# EAGLE schematic F7&UI&keyholder (EAGLE 9.4.0)
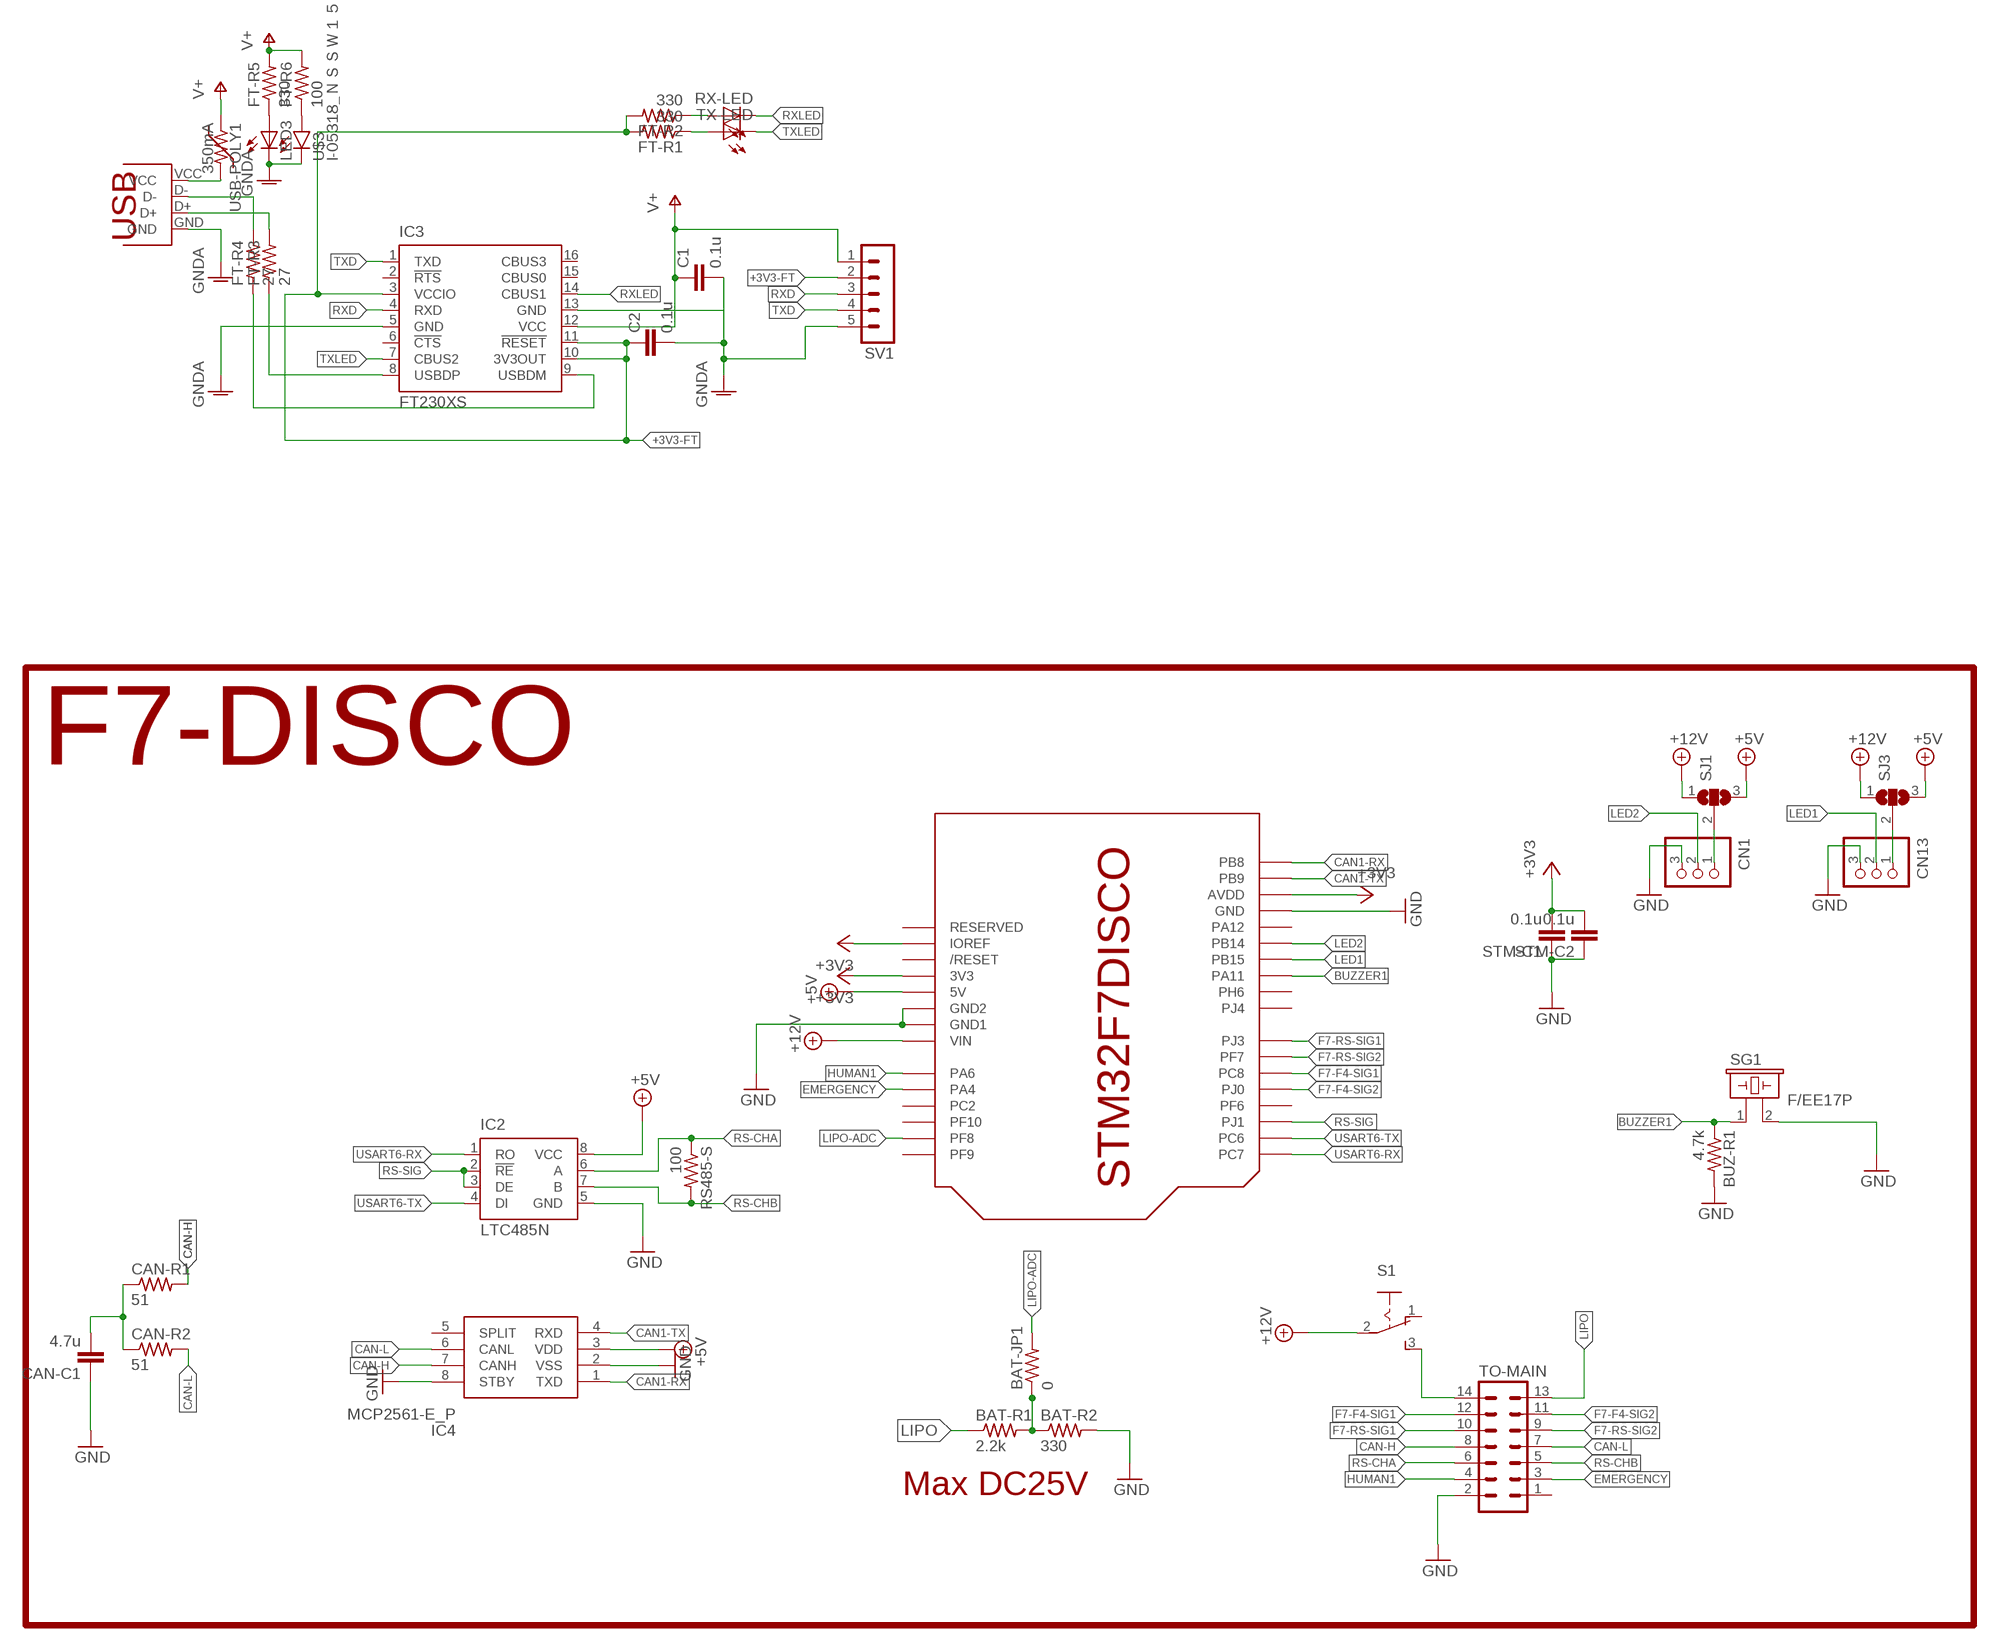
[diagram p0: schematic, sheet 1, part 1 of 2]
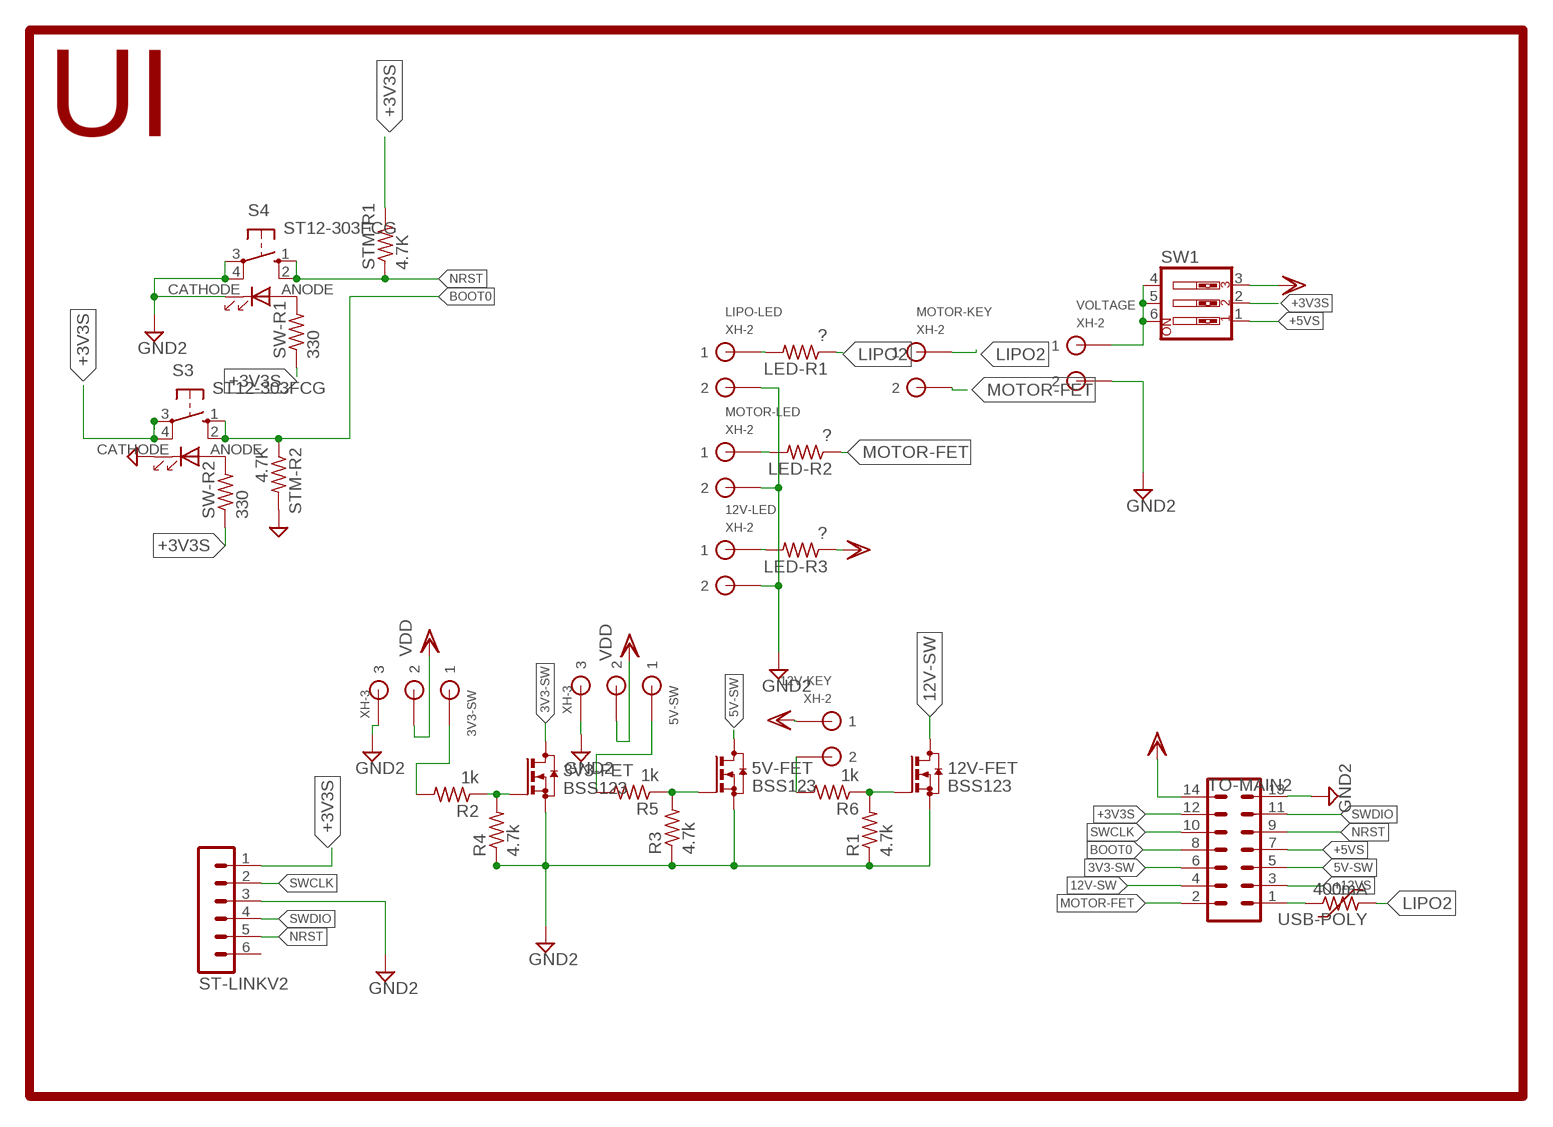
[diagram p1: schematic, sheet 1, part 2 of 2]

## Parts
3V3-FET  BSS123  [SOT23]
3V3-SW  XH-3  [CON3]
5V-FET  BSS123  [SOT23]
5V-SW  XH-3  [CON3]
12V-FET  BSS123  [SOT23]
12V-KEY  XH-2  [CON2]
12V-LED  XH-2  [CON2]
BAT-JP1  0  R-US_R0805  [R0805]
BAT-R1  2.2k  R-US_R0805  [R0805]
BAT-R2  330  R-US_R0805  [R0805]
BUZ-R1  4.7k  R-US_R0805  [R0805]
C1  0.1u  C-EUC1608  [C1608]
C2  0.1u  C-EUC1608  [C1608]
CAN-C1  4.7u  C-EUC0805  [C0805]
CAN-R1  51  R-US_R0805  [R0805]
CAN-R2  51  R-US_R0805  [R0805]
CN1  B3P-VH  [B3P-VH]
CN13  B3P-VH  [B3P-VH]
FT-R1  330  R-US_R0805  [R0805]
FT-R2  330  R-US_R0805  [R0805]
FT-R3  27  R-US_R0805  [R0805]
FT-R4  27  R-US_R0805  [R0805]
FT-R5  330  R-US_R0805  [R0805]
FT-R6  100  R-US_R0805  [R0805]
IC2  LTC485N  [DIL08]
IC3  FT230XS  [SSOP16]
IC4  MCP2561-E_P  [DIP781W56P254L950H533Q8N]
LED3  LEDCHIP-LED0805  [CHIP-LED0805]
LED-R1  ?  R-US_M0805  [M0805]
LED-R2  ?  R-US_M0805  [M0805]
LED-R3  ?  R-US_M0805  [M0805]
LIPO-LED  XH-2  [CON2]
MOTOR-KEY  XH-2  [CON2]
MOTOR-LED  XH-2  [CON2]
R1  4.7k  R-US_M0805  [M0805]
R2  1k  R-US_M0805  [M0805]
R3  4.7k  R-US_M0805  [M0805]
R4  4.7k  R-US_M0805  [M0805]
R5  1k  R-US_M0805  [M0805]
R6  1k  R-US_M0805  [M0805]
RS485-S  100  R-US_R0805  [R0805]
RX-LED  LEDCHIP-LED0805  [CHIP-LED0805]
S1  255SB  [255SB]
S3  ST12-303FCG  [ST12303FCG]
S4  ST12-303FCG  [ST12303FCG]
SG1  F/EE17P  [F/EE17P]
SJ1  SJ2WW  [SJ_2W]
SJ3  SJ2WW  [SJ_2W]
ST-LINKV2  MA06-1  [MA06-1]
STM-C1  0.1u  C-EUC0805  [C0805]
STM-C2  0.1u  C-EUC0805  [C0805]
STM-R1  4.7K  R-US_R0805  [R0805]
STM-R2  4.7K  R-US_R0805  [R0805]
SV1  MA05-1  [MA05-1]
SW1  SW_DIP-3  [EDG-03]
SW-R1  330  R-US_R0805  [R0805]
SW-R2  330  R-US_R0805  [R0805]
TO-MAIN  ML14  [ML14]
TO-MAIN2  ML14  [ML14]
TX-LED  LEDCHIP-LED0805  [CHIP-LED0805]
U$1  F7-DISCO-ARDUINO  [F7-DISCO-ARDUINO]
U$2  USB-PAD  [USB]
U$3  I-05318_ＮＳＳＷ１５７Ｔ  [NSSW157T]
USB-POLY  400mA  PTC-MF-5,1  [MF-5/1]
USB-POLY1  350mA  PTC-F0805MP  [F0805MP]
VOLTAGE  XH-2  [CON2]

## Nets
3V3-SW: 3V3-FET.3(D) TO-MAIN2.6
5V-SW: 5V-FET.3(D) TO-MAIN2.5
12V-SW: 12V-FET.3(D) TO-MAIN2.4
+3V3-FT: C2.1 FT-R1.2 FT-R2.2 IC3.3(VCCIO) IC3.10(3V3OUT) IC3.11(!RESET) SV1.2
+3V3S: S3.3 S3.4 ST-LINKV2.1 STM-R1.2 SW1.2 SW-R1.1 SW-R2.1 TO-MAIN2.12
+5V: IC2.8(VCC) IC4.3(VDD) SJ1.3 SJ3.3 U$1.5V
+5VS: SW1.1 TO-MAIN2.7
+9V: S1.2(P) SJ1.1 SJ3.1 U$1.VIN ; supply symbol labelled +12V
+12V: S1.3(S) TO-MAIN.14
+12VS: TO-MAIN2.3
BOOT0: S3.1 S3.2 STM-R2.1 TO-MAIN2.8
BUZZER1: BUZ-R1.1 SG1.1 U$1.PA11
CAN1-RX: IC4.1(TXD) U$1.PB8
CAN1-TX: IC4.4(RXD) U$1.PB9
CAN-H: CAN-R1.2 IC4.7(CANH) TO-MAIN.8
CAN-L: CAN-R2.2 IC4.6(CANL) TO-MAIN.7
EMERGENCY: TO-MAIN.3 U$1.PA4
F7-F4-SIG1: TO-MAIN.12 U$1.PC8
F7-F4-SIG2: TO-MAIN.11 U$1.PJ0
F7-RS-SIG1: TO-MAIN.10 U$1.PJ3
F7-RS-SIG2: TO-MAIN.9 U$1.PF7
GND: BAT-R2.2 BUZ-R1.2 CAN-C1.1 CN1.3 CN13.3 IC2.5(GND) IC4.2(VSS) IC4.8(STBY) SG1.2 STM-C1.1 STM-C2.1 TO-MAIN.2 U$1.GND1(GND) U$1.GND@1(GND1) U$1.GND@2(GND2)
GND2: 3V3-FET.2(S) 3V3-SW.P$3 5V-FET.2(S) 5V-SW.P$3 12V-FET.2(S) 12V-LED.P$2 LIPO-LED.P$2 MOTOR-LED.P$2 R1.1 R3.1 R4.1 S3.CATHODE(C) S4.3 S4.4 S4.CATHODE(C) ST-LINKV2.3 STM-R2.2 TO-MAIN2.13 VOLTAGE.P$2
GNDA: IC3.5(GND) LED3.C U$2.GND U$3.CATHODE(C)
HUMAN1: TO-MAIN.4 U$1.PA6
LED1: CN13.2 U$1.PB15
LED2: CN1.2 U$1.PB14
LIPO: BAT-R1.1 TO-MAIN.13
LIPO2: LED-R1.1 MOTOR-KEY.P$1 USB-POLY.1
LIPO-ADC: BAT-JP1.2 U$1.PF8
MOTOR-FET: LED-R2.1 MOTOR-KEY.P$2 TO-MAIN2.2
N$1: CN1.1 SJ1.2
N$2: 3V3-FET.1(G) R2.1 R4.2
N$3: 5V-FET.1(G) R3.2 R5.1
N$4: CAN-C1.2 CAN-R1.1 CAN-R2.1
N$6: SW1.4 SW1.5 SW1.6 VOLTAGE.P$1
N$7: 12V-FET.1(G) R1.2 R6.1
N$8: 12V-KEY.P$2 R6.2
N$9: 3V3-SW.P$1 R2.2
N$10: 5V-SW.P$1 R5.2
N$11: S4.ANODE(A) SW-R1.2
N$12: S3.ANODE(A) SW-R2.2
N$13: TO-MAIN2.1 USB-POLY.2
N$14: LED-R1.2 LIPO-LED.P$1
N$15: LED-R2.2 MOTOR-LED.P$1
N$16: 12V-LED.P$1 LED-R3.2
N$19: FT-R2.1 RX-LED.A
N$20: FT-R1.1 TX-LED.A
N$22: FT-R3.2 U$2.D+
N$23: FT-R3.1 IC3.8(USBDP)
N$24: FT-R4.1 IC3.9(USBDM)
N$25: FT-R4.2 U$2.D-
N$26: C1.2 C2.2 IC3.13(GND) SV1.5 ; supply symbol labelled GNDA
N$27: U$2.VCC USB-POLY1.2
N$28: FT-R5.1 LED3.A
N$29: FT-R6.1 U$3.ANODE(A)
N$36: BAT-JP1.1 BAT-R1.2 BAT-R2.1
N$37: CN13.1 SJ3.2
NRST: S4.1 S4.2 ST-LINKV2.5 STM-R1.1 TO-MAIN2.9
RS-CHA: IC2.6(A) RS485-S.1 TO-MAIN.6
RS-CHB: IC2.7(B) RS485-S.2 TO-MAIN.5
RS-SIG: IC2.2(!RE) IC2.3(DE) U$1.PJ1
RXD: IC3.4(RXD) SV1.3
RXLED: IC3.14(CBUS1) RX-LED.C
SWCLK: ST-LINKV2.2 TO-MAIN2.10
SWDIO: ST-LINKV2.4 TO-MAIN2.11
TXD: IC3.1(TXD) SV1.4
TXLED: IC3.7(CBUS2) TX-LED.C
USART6-RX: IC2.1(RO) U$1.PC7
USART6-TX: IC2.4(DI) U$1.PC6
V+: C1.1 FT-R5.2 FT-R6.2 IC3.12(VCC) SV1.1 USB-POLY1.1
VCC: STM-C1.2 STM-C2.2 U$1.3V(3V3) U$1.AVDD U$1.IOREF ; supply symbol labelled +3V3
VDD: 3V3-SW.P$2 5V-SW.P$2 12V-KEY.P$1 LED-R3.1 SW1.3 TO-MAIN2.14
Unconnected: IC3.2(!RTS) IC3.6(!CTS) IC3.15(CBUS0) IC3.16(CBUS3) IC4.5(SPLIT) S1.1(O) ST-LINKV2.6 TO-MAIN.1 U$1.PA12 U$1.PC2 U$1.PF6 U$1.PF9 U$1.PF10 U$1.PH6 U$1.PJ4 U$1.RESERVED U$1.RESET(/RESET)

## Notes on the sheet
- F7-DISCO | UI
- Max DC25V

## Library data of the parts
3V3-FET 5V-FET 12V-FET = transistor-small-signal:BSS123: N-CHANNEL MOS FET
3V3-SW 5V-SW = 0@Mylibrary-main1:XH-3: low insertion CON
12V-KEY 12V-LED LIPO-LED MOTOR-KEY MOTOR-LED VOLTAGE = 0@Mylibrary-main1:XH-2: low insertion CON
BAT-JP1 BAT-R1 BAT-R2 BUZ-R1 CAN-R1 CAN-R2 FT-R1-FT-R6 RS485-S STM-R1 STM-R2 SW-R1 SW-R2 = 0@Mylibrary-main1:R-US_: RESISTOR, American symbol
C1 C2 = resistor:C-EU: CAPACITOR, European symbol
CAN-C1 STM-C1 STM-C2 = rcl:C-EU: CAPACITOR, European symbol
CN1 CN13 = jst-vh:B3P-VH: Wire-to-Board 3.96mm pitch top mount connector Source: http://www.jst-mfg.com/product/pdf/jpn/VH.pdf http://www.jst-mfg.com/product/detail.php?series=262
IC2 = 0linear-technology:LTC485: Low Power RS485 Interface Transceiver Source: http://www.linear.com/pc/downloadDocument.do?navId=H0,C1,C1007,C1017,P2064,D1718; OC_FARNELL: unknown; OC_NEWARK: unknown
IC3 = ftdichip:FT230X: USB to BASIC UART IC Auto generated by make-symbol-device-package-bsdl.ulp Rev. 43 Source: Data sheet <http://www.ftdichip.com/Support/Documents/DataSheets/ICs/DS_FT230X.pdf>
IC4 = MCP2561-E_P:MCP2561-E_P: CAN Transceiver 1Mbps 5V 125degC PDIP8 Microchip MCP2561-E/P, CAN Transceiver 1-channel IEC 61000-4-2, 8-Pin PDIP Source: Datasheet <http://uk.rs-online.com/web/p/products/7990212>; ALLIED_NUMBER: 70415102; ALLIED_PRICE-STOCK: https://www.alliedelec.com/microchip-technology-inc-mcp2561-e-p/70415102/; DESCRIPTION: CAN Transceiver 1Mbps 5V 125degC PDIP8 Microchip MCP2561-E/P, CAN Transceiver 1-channel IEC 61000-4-2, 8-Pin PDIP; HEIGHT: 5.334mm; MANUFACTURER_NAME: Microchip; MANUFACTURER_PART_NUMBER: MCP2561-E/P; MOUSER_PART_NUMBER: 579-MCP2561-E/P; MOUSER_PRICE-STOCK: https://www.mouser.com/Search/Refine.aspx?Keyword=579-MCP2561-E%2FP; RS_PART_NUMBER: 1652124; RS_PRICE-STOCK: http://uk.rs-online.com/web/p/products/1652124
LED3 RX-LED TX-LED = led:LED: LED OSRAM: - CHIPLED LG R971, LG N971, LY N971, LG Q971, LY Q971, LO R971, LY R971 LH N974, LH R974 LS Q976, LO Q976, LY Q976 LO Q996 - Hyper CHIPLED LW Q18S LB Q993, LB Q99A, LB R99A - SideLED LS A670, LO A670, LY A670, LG A670, LP A670 LB A673, LV A673, LT A673, LW A673 LH A674 LY A675 LS A676, LA A676, LO A676, LY A676, LW A676 LS A679, LY A679, LG A679 - Hyper Micro SIDELED® LS Y876, LA Y876, LO Y876, LY Y876 LT Y87S - SmartLED LW L88C, LW L88S LB L89C, LB L89S, LG L890 LS L89K, LO L89K, LY L89K LS L896, LA L896, LO L896, LY L896 - TOPLED LS T670, LO T670, LY T670, LG T670, LP T670 LSG T670, LSP T670, LSY T670, LOP T670, LYG T670 LG T671, LOG T671, LSG T671 LB T673, LV T673, LT T673, LW T673 LH T674 LS T676, LA T676, LO T676, LY T676, LB T676, LH T676, LSB T676, LW T676 LB T67C, LV T67C, LT T67C, LS T67K, LO T67K, LY T67K, LW E67C LS E67B, LA E67B, LO E67B, LY E67B, LB E67C, LV E67C, LT E67C LW T67C LS T679, LY T679, LG T679 LS T770, LO T770, LY T770, LG T770, LP T770 LB T773, LV T773, LT T773, LW T773 LH T774 LS E675, LA E675, LY E675, LS T675 LS T776, LA T776, LO T776, LY T776, LB T776 LHGB T686 LT T68C, LB T68C - Hyper Mini TOPLED® LB M676 - Mini TOPLED Santana® LG M470 LS M47K, LO M47K, LY M47K Source: http://www.osram.convergy.de LUXEON: - LUMILED® LXK2-PW12-R00, LXK2-PW12-S00, LXK2-PW14-U00, LXK2-PW14-V00 LXK2-PM12-R00, LXK2-PM12-S00, LXK2-PM14-U00 LXK2-PE12-Q00, LXK2-PE12-R00, LXK2-PE12-S00, LXK2-PE14-T00, LXK2-PE14-U00 LXK2-PB12-K00, LXK2-PB12-L00, LXK2-PB12-M00, LXK2-PB14-N00, LXK2-PB14-P00, LXK2-PB14-Q00 LXK2-PR12-L00, LXK2-PR12-M00, LXK2-PR14-Q00, LXK2-PR14-R00 LXK2-PD12-Q00, LXK2-PD12-R00, LXK2-PD12-S00 LXK2-PH12-R00, LXK2-PH12-S00 LXK2-PL12-P00, LXK2-PL12-Q00, LXK2-PL12-R00 Source: www.luxeon.com KINGBRIGHT: KA-3528ASYC Source: www.kingbright.com
LED-R1-LED-R3 R1-R6 = resistor:R-US_: RESISTOR, American symbol
S1 = 0switch:255SB: SLIDING SWITCH Distributor Buerklin, 11G810
S3 S4 = ST12-303FCG:ST12-303FCG: Pushbutton Switch Source: Datasheet <http://akizukidenshi.com/download/ST-12-303FC-G_SPEC.pdf>; DESCRIPTION: Pushbutton Switch; HEIGHT: 8mm; MANUFACTURER_NAME: Switronic; MANUFACTURER_PART_NUMBER: ST12-303FCG
SG1 = buzzer:F/EE17P: BUZZER Source: Buerklin; OC_FARNELL: unknown; OC_NEWARK: unknown
SJ1 SJ3 = jumper:SJ2W: SMD solder JUMPER
ST-LINKV2 = 0con-lstb:MA06-1: PIN HEADER; OC_FARNELL: unknown; OC_NEWARK: unknown
SV1 = 0con-lstb:MA05-1: PIN HEADER; OC_FARNELL: unknown; OC_NEWARK: unknown
SW1 = 0special:SW_DIP-3: DIP SWITCH
TO-MAIN TO-MAIN2 = 0con-harting-ml:ML14: HARTING; OC_FARNELL: unknown; OC_NEWARK: unknown
U$1 = F7-DISCO:F7-DISCO-ARDUINO
U$2 = USB-PAD:USB-PAD
U$3 = Akizuki:I-05318_ＮＳＳＷ１５７Ｔ
USB-POLY USB-POLY1 = polyswitch:PTC-: POLYSWITCH Polyswitch Resetable Fuses